# EAGLE design gripper-rev-2a (EAGLE 6.5.0)
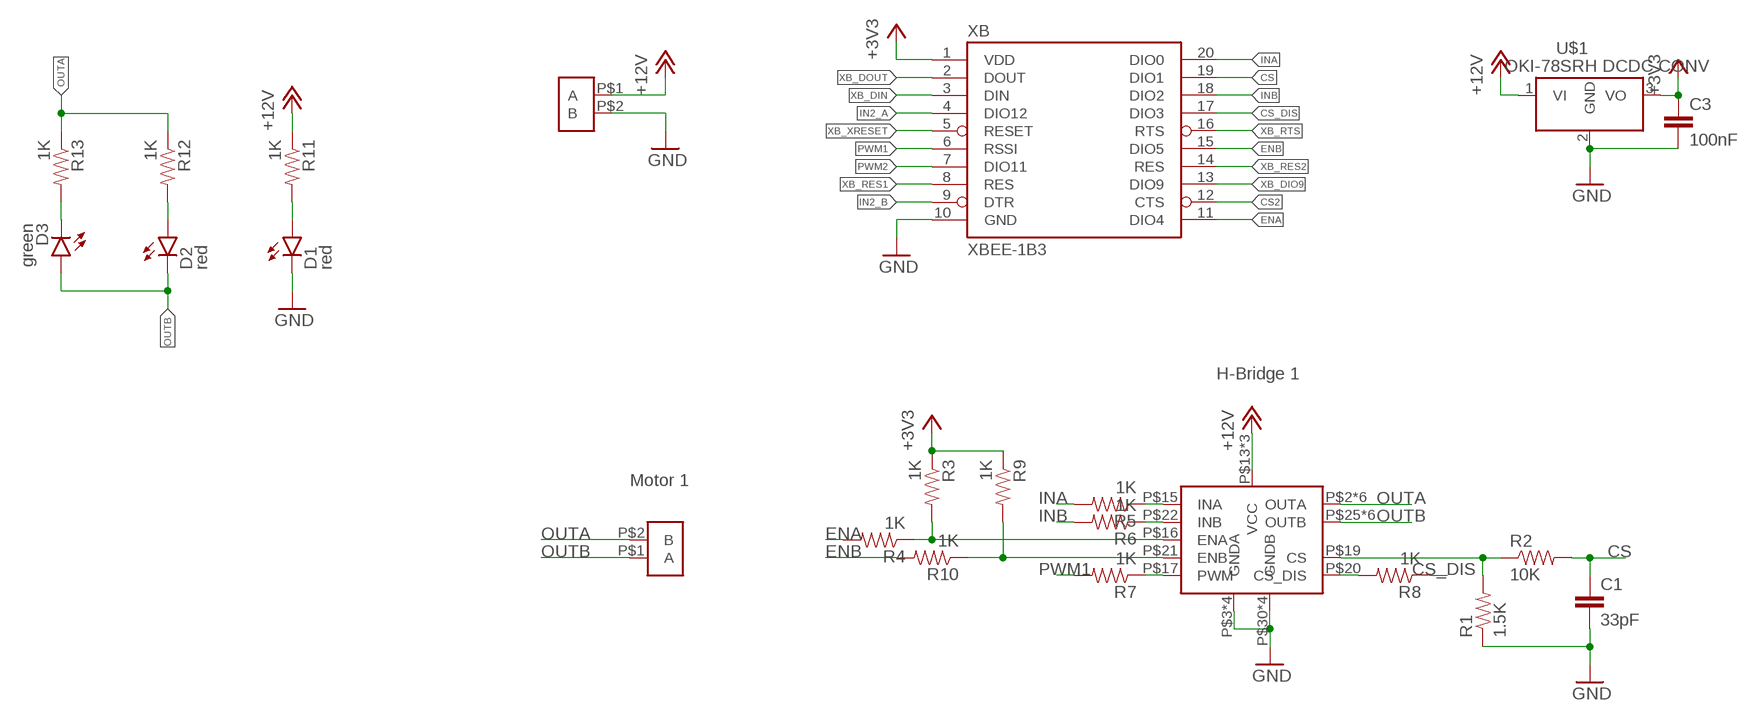
[diagram p0: schematic, sheet 1]

## Parts
C1  33pF  CAP0603-CAP  [0603-CAP]
C3  100nF  10NF/10000PF-50V-10%(0603)  [0603-CAP]
D1  red  LED0603  [LED-0603]
D2  red  LED0603  [LED-0603]
D3  green  LED0603  [LED-0603]
R1  1.5K  RESISTOR0603  [0603-RES]
R2  10K  RESISTOR0603  [0603-RES]
R3  1K  RESISTOR0603  [0603-RES]
R4  1K  RESISTOR0603  [0603-RES]
R5  1K  RESISTOR0603  [0603-RES]
R6  1K  RESISTOR0603  [0603-RES]
R7  1K  RESISTOR0603  [0603-RES]
R8  1K  RESISTOR0603  [0603-RES]
R9  1K  RESISTOR0603  [0603-RES]
R10  1K  RESISTOR0603  [0603-RES]
R11  1K  RESISTOR0603  [0603-RES]
R12  1K  RESISTOR0603  [0603-RES]
R13  1K  RESISTOR0603  [0603-RES]
U$1  Q_OKI-78SR  [OKI-78SR_HORIZ]
U$4  VNH5180A  [POWERSSO-36_TP]
U$6  TE_2POS_SCREW_TERM  [TE_2POS-5MM_SCREW_TERM]
U$8  TE_2POS_SCREW_TERM  [TE_2POS-5MM_SCREW_TERM]
XB  XBEE-1B3  [XBEE-SMD]

## Nets
+3V3: C3.1 R3.1 R9.1 U$1.3(VO) XB.1(VDD)
+12V: R11.1 U$1.1(VI) U$4.P$13(VCC) U$4.P$24(VCC) U$4.SLUG1(VCC) U$6.P$1(A)
CS: C1.1 R2.2 XB.19(DIO1)
CS2: XB.12(CTS)
CS_DIS: R8.1 XB.17(DIO3)
ENA: R4.2 XB.11(DIO4)
ENB: R10.2 XB.15(DIO5)
GND: C1.2 C3.2 D1.C R1.1 U$1.2(GND) U$4.P$3(GNDA) U$4.P$4(GNDA) U$4.P$6(GNDA) U$4.P$7(GNDA) U$4.P$30(GNDB) U$4.P$31(GNDB) U$4.P$33(GNDB) U$4.P$34(GNDB) U$6.P$2(B) XB.10(GND)
IN2_A: XB.4(DIO12)
IN2_B: XB.9(DTR)
INA: R5.2 XB.20(DIO0)
INB: R6.2 XB.18(DIO2)
N$2: R5.1 U$4.P$15(INA)
N$3: R1.2 R2.1 U$4.P$19(CS)
N$4: R6.1 U$4.P$22(INB)
N$5: R7.1 U$4.P$17(PWM)
N$6: R3.2 R4.1 U$4.P$16(ENA)
N$7: R9.2 R10.1 U$4.P$21(ENB)
N$8: R8.2 U$4.P$20(CS_DIS)
N$9: D1.A R11.2
N$11: D2.A R12.2
N$12: D3.C R13.2
OUTA: R12.1 R13.1 U$4.P$2(OUTA) U$4.P$8(OUTA) U$4.P$10(OUTA) U$4.P$11(OUTA) U$4.P$12(OUTA) U$4.SLUG2(OUTA) U$8.P$2(B)
OUTB: D2.C D3.A U$4.P$25(OUTB) U$4.P$26(OUTB) U$4.P$27(OUTB) U$4.P$29(OUTB) U$4.P$35(OUTB) U$4.SLUG3(OUTB) U$8.P$1(A)
PWM1: R7.2 XB.6(RSSI)
PWM2: XB.7(DIO11)
XB_DIN: XB.3(DIN)
XB_DIO9: XB.13(DIO9)
XB_RES1: XB.8(RES)
XB_RES2: XB.14(RES)
XB_RTS: XB.16(RTS)
XB_XRESET: XB.5(RESET)
Unconnected: XB.2(DOUT)

## Notes on the sheet
- H-Bridge 1
- Motor 1

## Library data of the parts
C1 = SparkFun-Passives:CAP: Capacitor Standard 0603 ceramic capacitor, and 0.1" leaded capacitor.
C3 = SparkFun-Capacitors:10NF/10000PF-50V-10%(0603): CAP-00867; PROD_ID: CAP-00867; VALUE: 10nF
D1-D3 = SparkFun-LED:LED: LEDs Standard schematic elements and footprints for 5mm, 3mm, 1206, and 0603 sized LEDs. 5mm - Spark Fun Electronics SKU : COM-00529 (and others)
R1-R13 = SparkFun-Resistors:RESISTOR: Resistor Basic schematic elements and footprints for 0603, 1206, and PTH resistors.
U$1 = MRDT-2015-PowerBoard:Q_OKI-78SR: 4.95W DC/DC Converter Manufacturer: Murata Part Number: OKI-78SR-5/1.5-W36H-C OKI-78SR-3.3/1.5-W36H-C
U$4 = MRDT-PowerICs:VNH5180A
U$6 U$8 = MRDT-Connectors:TE_2POS_SCREW_TERM
XB = SparkFun:XBEE-1

## Board
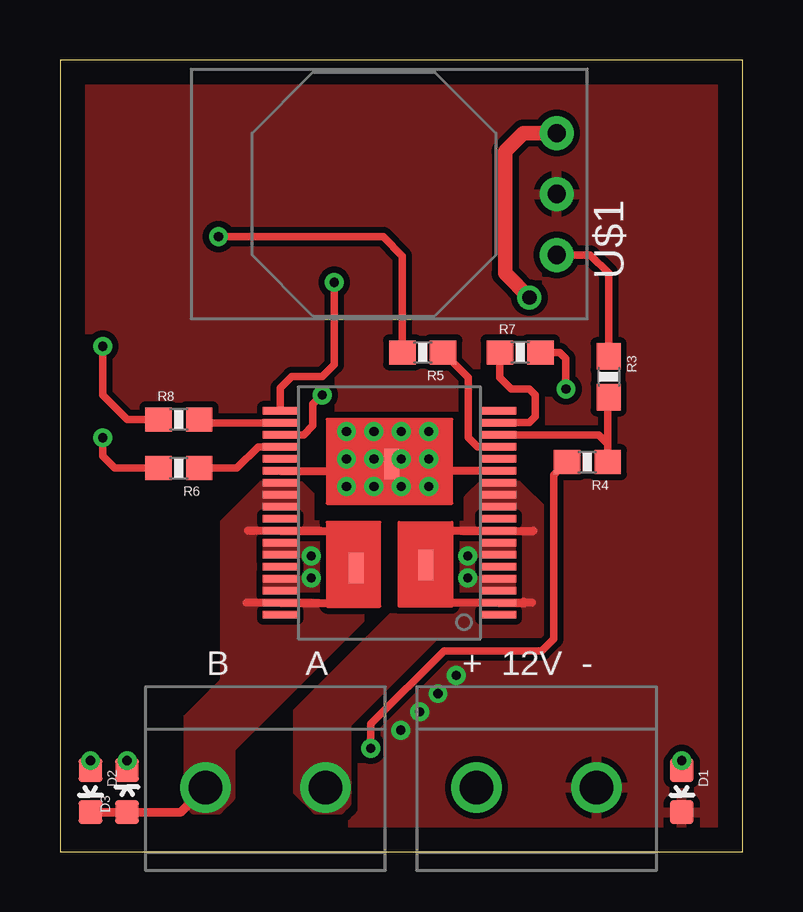
[diagram p1: board, top side]
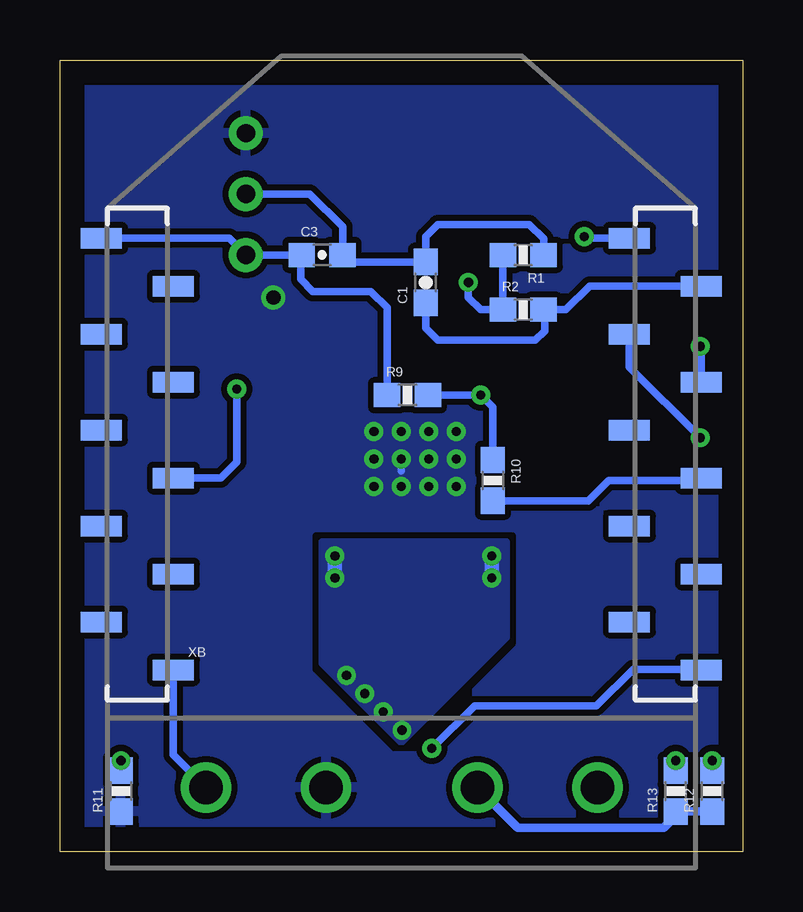
[diagram p2: board, bottom side, seen from below]

Size 28.45 x 33.02 mm. Coordinates in mm from the lower left corner, seen from the top.
Outline: 0,0 28.45,0 28.45,33.02 0,33.02 0,0
Copper layers (1*16): Top 0.035mm / dielectric 1.5mm / Bottom 0.035mm
Design rules "default": minimum track width 10mil, minimum drill 24mil, track to track 8mil, track to pad 8mil, pad to pad 8mil, via to via 8mil, smd to smd 8mil, copper to edge 40mil, drill to drill 8mil, minimum pad ring 10mil, minimum via ring 8mil, stop-mask expansion 4mil, vias tented up to drill 0mil, thermal gap 10mil

### Footprints (pad centres in the part's own frame; a part is rotated, then mirrored left to right if it is on the bottom)
0603-CAP = smd 1.1 x 1: 1 -0.85,0; 2 0.85,0
LED-0603 = smd 1 x 1: A 0,-0.877; C 0,0.877
0603-RES = smd 1.1 x 1: 1 -0.85,0; 2 0.85,0
OKI-78SR_HORIZ = drill 0.762 pad 1.422: 1 0,0; 2 -2.54,0; 3 -5.08,0
POWERSSO-36_TP = smd 0.322 x 1.45: P$1 1,-0.75; P$2 1.5,-0.75; P$3 2,-0.75; P$4 2.5,-0.75; P$5 3,-0.75; P$6 3.5,-0.75; P$7 4,-0.75; P$8 4.5,-0.75; P$9 5,-0.75; P$10 5.5,-0.75; P$11 6,-0.75; P$12 6.5,-0.75; P$13 7,-0.75; P$14 7.5,-0.75; P$15 8,-0.75; P$16 8.5,-0.75; P$17 9,-0.75; P$18 9.5,-0.75; P$19 9.5,8.35; P$20 9,8.35; P$21 8.5,8.35; P$22 8,8.35; P$23 7.5,8.35; P$24 7,8.35; P$25 6.5,8.35; P$26 6,8.35; P$27 5.5,8.35; P$28 5,8.35; P$29 4.5,8.35; P$30 4,8.35; P$31 3.5,8.35; P$32 3,8.35; P$33 2.5,8.35; P$34 2,8.35; P$35 1.5,8.35; P$36 1,8.35 | smd 1.27 x 0.635: SLUG1 7.29,3.708; SLUG2 3.073,2.286; SLUG3 2.946,5.182
TE_2POS-5MM_SCREW_TERM = drill 1.4: P$1 2.5,3.45; P$2 7.5,3.45
XBEE-SMD = smd 1.7 x 0.85: 1 -12.5,20; 2 -9.5,18; 3 -12.5,16; 4 -9.5,14; 5 -12.5,12; 6 -9.5,10; 7 -12.5,8; 8 -9.5,6; 9 -12.5,4; 10 -9.5,2; 11 12.5,2; 12 9.5,4; 13 12.5,6; 14 9.5,8; 15 12.5,10; 16 9.5,12; 17 12.5,14; 18 9.5,16; 19 12.5,18; 20 9.5,20

### Placement (x,y rotation side)
C1  13.21,23.75 90 bottom
C3  17.53,24.89 0 bottom
D1  25.91,2.54 180 top
D2  1.27,2.54 180 top
D3  2.79,2.54 0 top
R1  9.14,24.89 180 bottom
R2  9.14,22.61 0 bottom
R3  22.86,19.81 270 top
R4  21.97,16.26 180 top
R5  15.11,20.83 180 top
R6  4.95,16 180 top
R7  19.18,20.83 0 top
R8  4.95,18.03 0 top
R9  13.97,19.05 0 bottom
R10  10.41,15.49 270 bottom
R11  25.91,2.54 90 bottom
R12  1.27,2.54 90 bottom
R13  2.79,2.54 90 bottom
U$1  20.7,29.97 90 top
U$4  17.53,8.89 90 top
U$6  14.86,-0.76 0 top
U$8  3.56,-0.76 0 top
XB  14.22,5.59 0 bottom

### Tracks (layer width: path | path; a pad name or v marks a point on that pad's centre or on a via)
+3V3
  Top 0.305: R3.1 22.86,24.13 22.1,24.89 U$1.3
  Bottom 0.305: XB.1 21.4,25.59 U$1.3 C3.1 18.41,24.85 18.41,23.88 17.91,23.37 15.49,23.37 14.82,22.69 R9.1
+12V  (via drill 0.38, 0.38 pad 0.3, 0.6)
  Top 0.33: U$4.P$24 13.82,15.89 | U$4.P$13 14.22,15.89
  Top 0.406: U$4.SLUG1 13.82,15.89 14.22,15.89 v14.22,16.38
  Top 0.61: U$1.1 19.3,29.97 18.54,29.21 18.54,24.13 v19.56,23.11
  Bottom 0.305: v14.22,16.38 14.22,15.89
  other vias: 11.94,15.24 13.08,15.24 14.22,15.24 15.37,15.24 15.37,16.38 13.08,16.38 11.94,16.38 11.94,17.53 13.08,17.53 14.22,17.53 15.37,17.53
  pour Bottom (isolate 0.254, rank 6): -3.3,33.53 32.26,33.53 32.26,-4.06 -3.3,-4.06
CS
  Bottom 0.305: XB.19 6.38,23.59 7.37,22.61 R2.2 | 8.26,22.57 8.26,21.72 8.64,21.34 12.7,21.34 13.21,21.84 C1.1
  Bottom 0.406: 8.26,22.57 R2.2
CS_DIS  (via drill 0.38)
  Top 0.305: R8.1 2.79,18.03 1.78,19.05 v1.78,21.08
  Bottom 0.305: XB.17 1.72,21.03 v1.78,21.08
ENA  (via drill 0.38)
  Top 0.305: v12.95,4.32 12.95,5.33 16,8.38 20.07,8.38 20.57,8.89 20.57,15.71 R4.2
  Bottom 0.305: v12.95,4.32 11.18,6.1 6.1,6.1 4.57,7.62 1.76,7.62 XB.11
ENB
  Bottom 0.305: R10.2 6.44,14.64 5.59,15.49 1.82,15.49 XB.15
GND  (via drill 0.38)
  Bottom 0.305: C3.2 16.68,26.07 18.03,27.43 U$1.2 | R1.1 8.29,25.57 8.89,26.16 12.7,26.16 13.21,25.65 C1.2 16.38,24.6 | XB.10 23.72,4.05 U$6.P$2
  Bottom 0.406: 16.38,24.6 C3.2
  Bottom 0.61: v10.46,11.43 v10.46,12.34 | v16.99,11.43 16.99,12.32 16.97,12.32
  other vias: 16.99,12.34 14.2,5.08 14.99,5.84 15.75,6.6 16.51,7.37
  pour Top (isolate 0.254, rank 6): -5.08,34.04 30.99,34.04 30.99,-4.57 -5.08,-4.57
  pour Top (isolate 0.254, no thermals): 16.76,10.9 18.82,10.9 18.82,11.38 18.8,11.38 18.82,12.4 18.82,12.88 16.76,12.88
  pour Top (isolate 0.254, no thermals): 10.67,10.9 8.64,10.9 8.64,12.88 10.67,12.88
  pour Bottom (isolate 0.254): 9.86,12.93 17.53,12.93 17.53,7.87 14.22,4.57 9.86,8.94
INA  (via drill 0.38)
  Top 0.305: R5.2 14.26,24.85 13.46,25.65 v6.6,25.65
  Bottom 0.305: XB.20 6.54,25.59 v6.6,25.65
INB  (via drill 0.38)
  Top 0.305: R6.2 2.29,16 1.78,16.51 v1.78,17.27
  Bottom 0.305: XB.18 4.72,20.22 v1.78,17.27
N$2
  Top 0.305: R5.1 17.02,19.77 17.02,17.27 17.4,16.89 U$4.P$15
N$3  (via drill 0.38)
  Top 0.305: U$4.P$19 9.18,19.34 9.65,19.81 10.92,19.81 11.43,20.32 v11.43,23.75
  Bottom 0.305: R1.2 R2.1 10.92,22.61 11.43,23.11 v11.43,23.75
N$4
  Top 0.305: U$4.P$22 8.25,16.89 7.37,16 R6.1
N$5
  Top 0.305: R7.1 18.33,19.77 18.8,19.3 19.56,19.3 19.81,19.05 19.81,18.16 19.56,17.91 18.29,17.91 U$4.P$17
N$6
  Top 0.305: R4.1 22.82,17.02 | 22.82,17.02 22.82,18.92 R3.2 | U$4.P$16 22.45,17.39 22.82,17.02
N$7  (via drill 0.38)
  Top 0.305: U$4.P$21 10.15,17.39 10.54,17.78 10.54,18.67 v10.92,19.05
  Bottom 0.305: R9.2 v10.92,19.05 10.41,18.54 R10.1
N$8
  Top 0.305: U$4.P$20 5.95,17.89
  Top 0.406: 5.95,17.89 R8.2
N$9  (via drill 0.38)
  Top 0.356: D1.A v25.91,3.81
  Bottom 0.356: R11.2 v25.91,3.81
N$11  (via drill 0.38)
  Top 0.356: D2.A v1.27,3.81
  Bottom 0.356: R12.2 v1.27,3.81
N$12  (via drill 0.38)
  Top 0.356: D3.C v2.79,3.81
  Bottom 0.356: R13.2 v2.79,3.81
OUTA
  Top 0.33: U$4.P$8 15.24,13.39 | 19.66,10.39 19.3,10.39 16.08,10.39 | U$4.P$2 19.3,10.39 | 16.79,13.39 19.74,13.39
  Top 0.406: 15.24,13.39 U$4.SLUG2 | 19.3,10.39
  Bottom 0.356: R12.1 R13.1 2.79,1.52 3.3,1.02 9.38,1.02 U$8.P$2
  pour Top (no thermals): 17.7,15.42 18.85,15.42 18.85,14.35 17.7,14.35
  pour Top (rank 5, no thermals): 15.75,10.41 14.22,10.41 14.22,13.46 16.26,13.46
  pour Top (isolate 0.254, rank 5, no thermals): 10.67,1.78 11.68,1.78 11.94,2.03 11.94,5.33 15.75,9.14 20.32,9.14 20.32,14.05 19,15.37 17.65,15.37 17.02,14.73 17.02,13.59 14.27,13.59 14.27,10.21 9.91,5.84 9.91,2.54
OUTB
  Top 0.33: U$4.P$29 12.34,13.39 | U$4.P$35 9.6,10.39 | 9.6,10.39 10.46,10.39 | 10.46,10.39 11.71,10.39 | U$4.P$35 9.37,10.39 9.6,10.39 | 10.46,10.39 7.77,10.39 | 10.85,13.39 7.82,13.39
  Top 0.356: D2.C D3.A 5.03,1.66 U$8.P$1
  Top 0.406: 12.34,13.39 U$4.SLUG3
  pour Top (no thermals): 9.75,15.42 8.61,15.42 8.61,14.35 9.75,14.35
  pour Top (isolate 0.254, rank 5, no thermals): 5.59,1.78 6.6,1.78 7.11,2.29 7.11,4.32 13.21,10.41 13.21,13.61 10.41,13.61 10.41,14.86 9.91,15.37 8.51,15.37 6.86,13.72 6.86,7.11 5.33,5.59 5.33,2.03
PWM1  (via drill 0.38)
  Top 0.305: R7.2 20.83,20.83 21.08,20.57 v21.08,19.3
  Bottom 0.305: XB.6 21.75,15.59 21.08,16.26 v21.08,19.3

### Text on the board
tPlace: B A | + 12V -